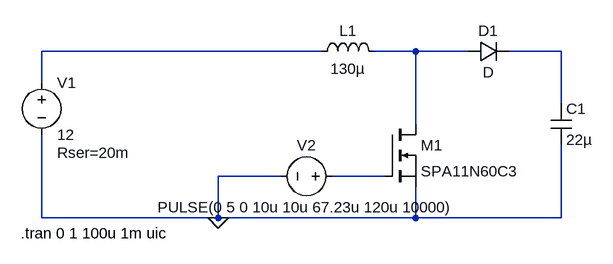
[diagram p0: schematic Boost-Converter-12V-450V-1V00.asc]
Boost-Converter-12V-450V-1V00.asc, the LTspice schematic file:
Version 4
SHEET 1 880 680
WIRE 224 32 -208 32
WIRE 368 32 304 32
WIRE 448 32 368 32
WIRE 592 32 512 32
WIRE -208 80 -208 32
WIRE 592 112 592 32
WIRE 368 144 368 32
WIRE 160 224 64 224
WIRE 320 224 240 224
WIRE -208 288 -208 160
WIRE 64 288 64 224
WIRE 64 288 -208 288
WIRE 368 288 368 240
WIRE 368 288 64 288
WIRE 592 288 592 176
WIRE 592 288 368 288
FLAG 64 288 0
SYMBOL voltage -208 64 R0
WINDOW 123 0 0 Left 2
WINDOW 39 24 124 Left 2
SYMATTR SpiceLine Rser=20m
SYMATTR InstName V1
SYMATTR Value 12
SYMBOL ind 208 48 R270
WINDOW 0 32 56 VTop 2
WINDOW 3 5 56 VBottom 2
SYMATTR InstName L1
SYMATTR Value 130µ
SYMATTR SpiceLine Rser=100m
SYMBOL nmos 320 144 R0
SYMATTR InstName M1
SYMATTR Value SPA11N60C3
SYMBOL diode 448 48 R270
WINDOW 0 32 32 VTop 2
WINDOW 3 0 32 VBottom 2
SYMATTR InstName D1
SYMBOL cap 576 112 R0
SYMATTR InstName C1
SYMATTR Value 22µ
SYMBOL voltage 256 224 R90
WINDOW 0 -32 56 VBottom 2
WINDOW 3 32 56 VTop 2
WINDOW 123 0 0 Left 2
WINDOW 39 0 0 Left 2
SYMATTR InstName V2
SYMATTR Value PULSE(0 5 0 10u 10u 67.23u 120u 10000)
TEXT -240 312 Left 2 !.tran 0 1 100u 1m uic

The netlist it stands for:
* Boost-Converter-12V-450V-1V00.asc
V1 N001 0 12 Rser=20m
L1 N001 N002 130µ Rser=100m
M1 N002 N004 0 0 SPA11N60C3
D1 N002 N003 D
C1 N003 0 22µ
V2 N004 0 PULSE(0 5 0 10u 10u 67.23u 120u 10000)
.model D D
.lib standard.dio
.model NMOS NMOS
.model PMOS PMOS
.lib standard.mos
.tran 0 1 100u 1m uic
.backanno
.end